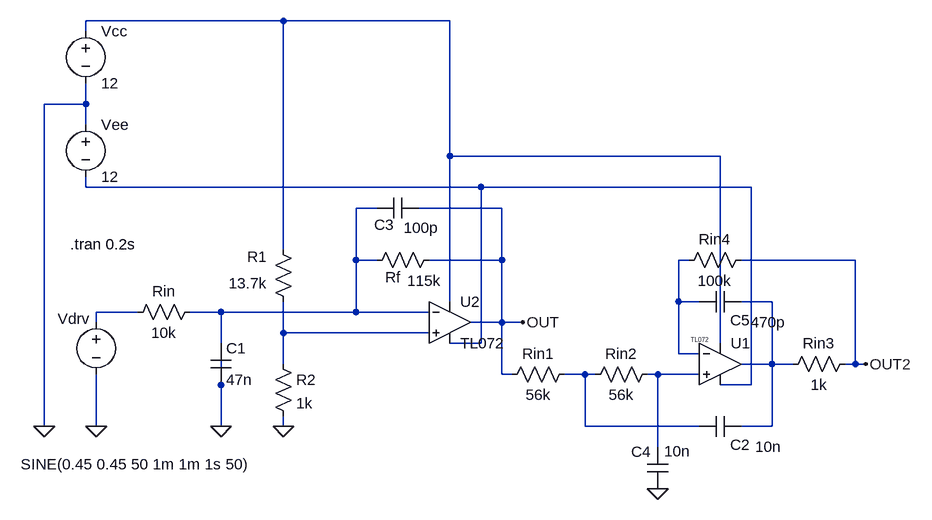
[diagram p0: schematic touch_def.asc]
touch_def.asc, the LTspice schematic file:
Version 4
SHEET 1 1184 680
WIRE 208 -352 -96 -352
WIRE 464 -352 208 -352
WIRE -96 -336 -96 -352
WIRE -96 -224 -96 -256
WIRE -96 -224 -160 -224
WIRE -96 -192 -96 -224
WIRE 464 -144 464 -352
WIRE 880 -144 464 -144
WIRE -96 -96 -96 -112
WIRE 512 -96 -96 -96
WIRE 928 -96 512 -96
WIRE 352 -64 320 -64
WIRE 544 -64 416 -64
WIRE 208 0 208 -352
WIRE 320 16 320 -64
WIRE 352 16 320 16
WIRE 544 16 544 -64
WIRE 544 16 432 16
WIRE 832 16 816 16
WIRE 1088 16 912 16
WIRE 464 80 464 -144
WIRE 816 80 816 16
WIRE 848 80 816 80
WIRE 960 80 912 80
WIRE -16 96 -80 96
WIRE 112 96 64 96
WIRE 320 96 320 16
WIRE 320 96 112 96
WIRE 432 96 320 96
WIRE -80 112 -80 96
WIRE 544 112 544 16
WIRE 544 112 496 112
WIRE 576 112 544 112
WIRE 208 128 208 80
WIRE 432 128 208 128
WIRE 112 144 112 96
WIRE 512 144 512 -96
WIRE 512 144 464 144
WIRE 880 144 880 -144
WIRE 816 160 816 80
WIRE 848 160 816 160
WIRE 208 176 208 128
WIRE 960 176 960 80
WIRE 960 176 912 176
WIRE 992 176 960 176
WIRE 1088 176 1088 16
WIRE 1088 176 1072 176
WIRE 1104 176 1088 176
WIRE 544 192 544 112
WIRE 560 192 544 192
WIRE 672 192 640 192
WIRE 688 192 672 192
WIRE 784 192 768 192
WIRE 848 192 784 192
WIRE 112 208 112 160
WIRE 928 208 928 -96
WIRE 928 208 880 208
WIRE -160 272 -160 -224
WIRE -80 272 -80 192
WIRE 112 272 112 208
WIRE 208 272 208 256
WIRE 672 272 672 192
WIRE 848 272 672 272
WIRE 960 272 960 176
WIRE 960 272 912 272
WIRE 784 304 784 192
FLAG -160 272 0
FLAG -80 272 0
FLAG 576 112 OUT
FLAG 208 272 0
FLAG 112 272 0
FLAG 784 368 0
FLAG 1104 176 OUT2
SYMBOL voltage -96 -352 R0
WINDOW 123 0 0 Left 0
WINDOW 39 0 0 Left 0
SYMATTR InstName Vcc
SYMATTR Value 12
SYMBOL voltage -80 96 R0
WINDOW 123 0 0 Left 0
WINDOW 39 0 0 Left 0
WINDOW 0 -59 10 Left 2
WINDOW 3 -116 234 Left 2
SYMATTR InstName Vdrv
SYMATTR Value SINE(0.45 0.45 50 1m 1m 1s 50)
SYMBOL voltage -96 -208 R0
WINDOW 123 0 0 Left 0
WINDOW 39 0 0 Left 0
SYMATTR InstName Vee
SYMATTR Value 12
SYMBOL res 80 80 R90
WINDOW 0 0 56 VBottom 2
WINDOW 3 32 56 VTop 2
SYMATTR InstName Rin
SYMATTR Value 10k
SYMBOL res 448 0 R90
WINDOW 0 58 71 VBottom 2
WINDOW 3 32 23 VTop 2
SYMATTR InstName Rf
SYMATTR Value 115k
SYMBOL OpAmps\\TL072 464 48 R0
SYMATTR InstName U2
SYMBOL res 192 -16 R0
WINDOW 0 -40 27 Left 2
WINDOW 3 -68 68 Left 2
SYMATTR InstName R1
SYMATTR Value 13.7k
SYMBOL res 192 160 R0
SYMATTR InstName R2
SYMATTR Value 1k
SYMBOL cap 416 -80 R90
WINDOW 0 57 53 VBottom 2
WINDOW 3 31 -4 VTop 2
SYMATTR InstName C3
SYMATTR Value 100p
SYMBOL cap 96 144 R0
SYMATTR InstName C1
SYMATTR Value 47n
SYMBOL OpAmps\\TL072 880 112 R0
WINDOW 3 -45 27 Left 0
SYMATTR InstName U1
SYMBOL res 656 176 R90
WINDOW 0 0 56 VBottom 2
WINDOW 3 32 56 VTop 2
SYMATTR InstName Rin1
SYMATTR Value 56k
SYMBOL res 784 176 R90
WINDOW 0 0 56 VBottom 2
WINDOW 3 32 56 VTop 2
SYMATTR InstName Rin2
SYMATTR Value 56k
SYMBOL cap 912 256 R90
WINDOW 0 60 1 VBottom 2
WINDOW 3 32 -42 VTop 2
SYMATTR InstName C2
SYMATTR Value 10n
SYMBOL cap 768 304 R0
WINDOW 0 -25 7 Left 2
WINDOW 3 26 6 Left 2
SYMATTR InstName C4
SYMATTR Value 10n
SYMBOL cap 912 64 R90
WINDOW 0 60 1 VBottom 2
WINDOW 3 32 -42 VTop 2
SYMATTR InstName C5
SYMATTR Value 470p
SYMBOL res 1088 160 R90
WINDOW 0 0 56 VBottom 2
WINDOW 3 32 56 VTop 2
SYMATTR InstName Rin3
SYMATTR Value 1k
SYMBOL res 928 0 R90
WINDOW 0 0 56 VBottom 2
WINDOW 3 32 56 VTop 2
SYMATTR InstName Rin4
SYMATTR Value 100k
TEXT -120 -8 Left 2 !.tran 0.2s

The netlist it stands for:
* touch_def.asc
Vcc N001 0 12
Vdrv N006 0 SINE(0.45 0.45 50 1m 1m 1s 50)
Vee 0 N002 12
Rin N003 N006 10k
Rf OUT N003 115k
XU2 N007 N003 N001 N002 OUT TL072  ; pins In+ In- V+ V- OUT
R1 N001 N007 13.7k
R2 N007 0 1k
C3 OUT N003 100p
C1 N003 0 47n
XU1 N009 N004 N001 N002 N005 TL072  ; pins In+ In- V+ V- OUT
Rin1 N008 OUT 56k
Rin2 N009 N008 56k
C2 N005 N008 10n
C4 N009 0 10n
C5 N005 N004 470p
Rin3 OUT2 N005 1k
Rin4 OUT2 N004 100k
.tran 0.2s
.backanno
.end